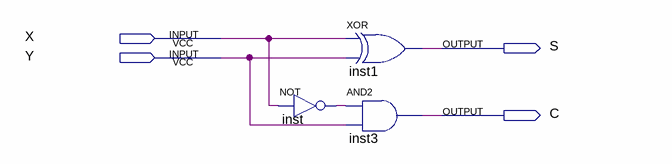
[diagram p0: schematic sheet]
// Quartus schematic Meio_Subtrator.bdf as structural Verilog: 3 symbols, 4 pins
module Meio_Subtrator (
  input  X,
  input  Y,
  output S,
  output C
);

  wire inst_out;

  not inst (inst_out, X);
  xor inst1 (S, X, Y);
  and inst3 (C, inst_out, Y);
endmodule
